# Altium schematic sheet P1.schdoc
size 297 x 209 mm; @Create Time: 14:32:22; @Board Name: Board1; @Update Time: 10:41:13; Border: 1; Title Block Position: 3; Width: 1170; Height: 825; Region Start: 1; X Region Count: 6; Y Region Count: 4; Blade Width: 10; Title Block: 1; Symbol: Sheet_WMY_A4; @Project Name: SparkinFP01; @Schematic Name: Schematic1; @Page Name: P1; @Page Count: 1; @Update Date: 2025-07-31; @Create Date: 2025-07-05; @Page No: 1; Drawed: Tomosawa; Device: Sheet_WMY_A4
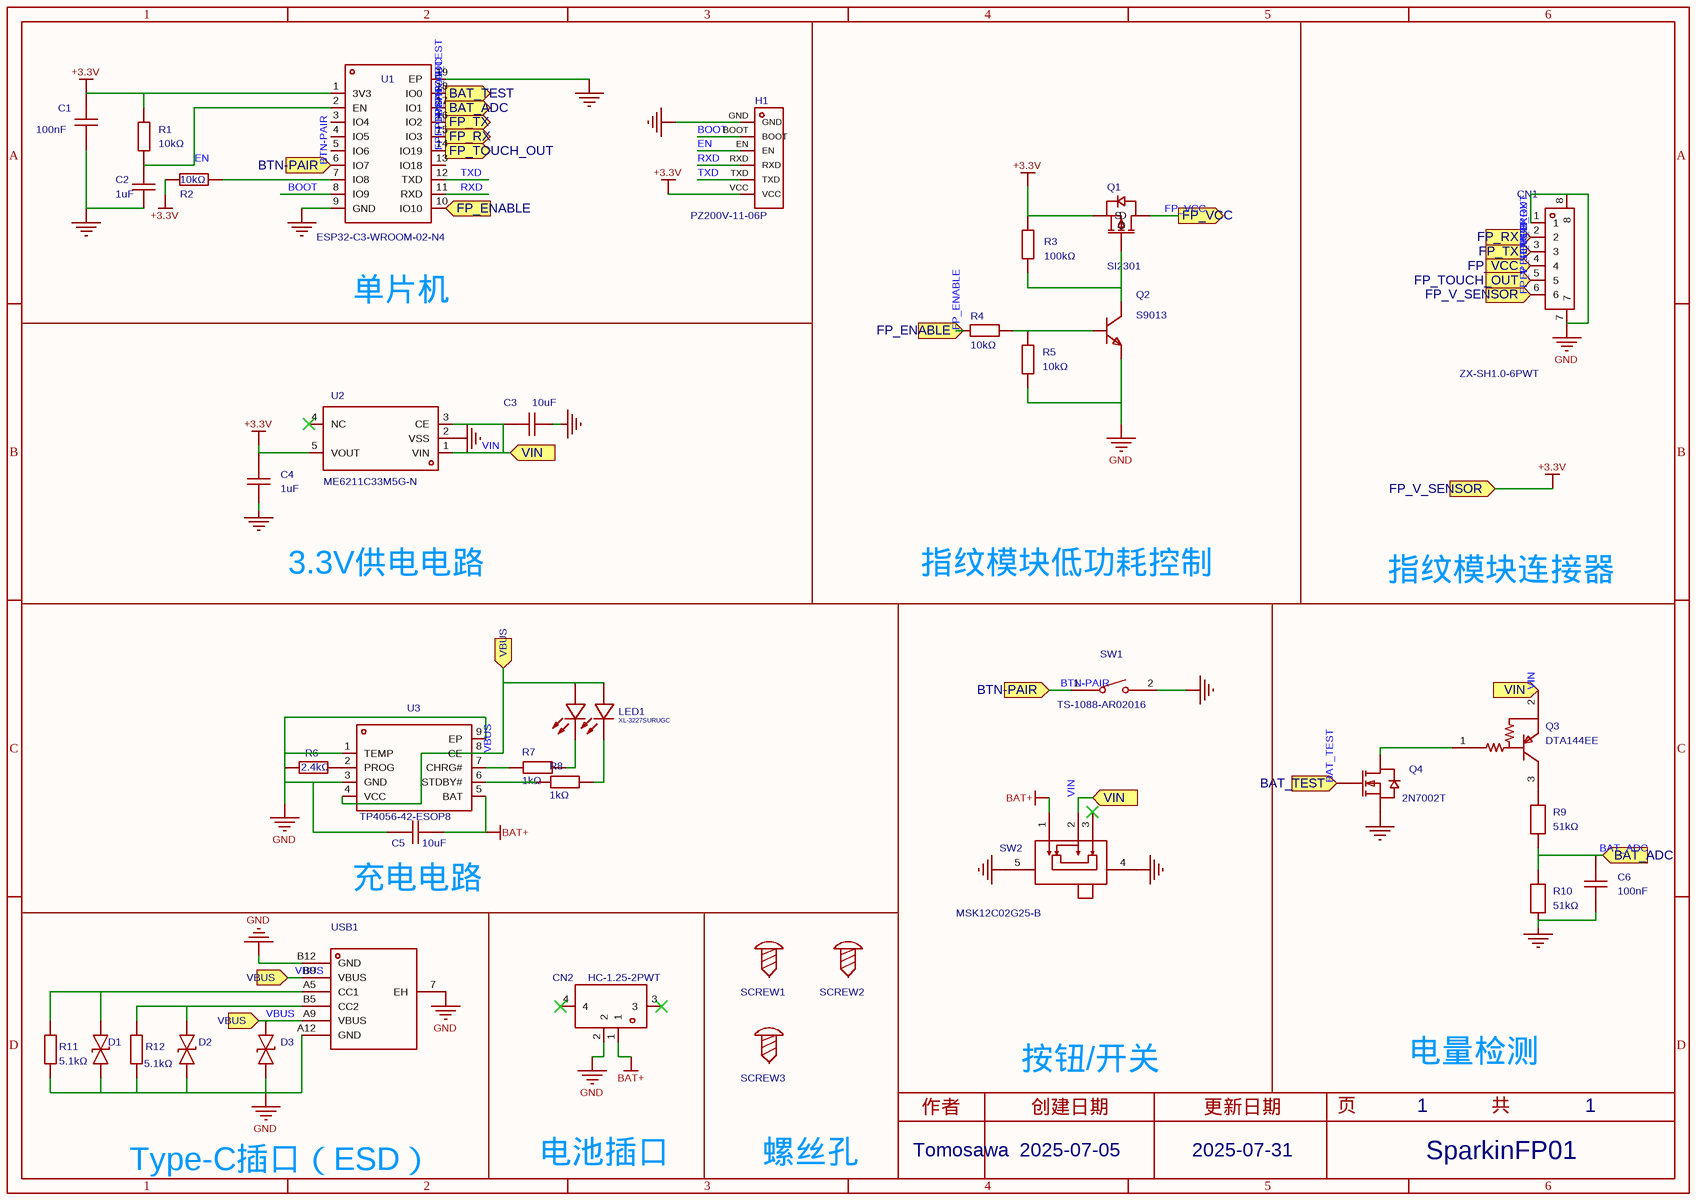
[diagram p0: P1.schdoc]

## Parts
C1  100nF  [C0603]
C2  1uF  [C0603]
C3  10uF  [C0603]
C4  1uF  [C0603]
C5  10uF  [C0603]
C6  100nF  [C0603]
CN1  ZX-SH1.0-6PWT  [CONN-SMD_6P-P1.00_MEGASTAR_ZX-SH1.0-6PWT]
CN2  HC-1.25-2PWT  [CONN-SMD_2P-P1.25-HC-1.25-2PWT]
D1  LESD5D5.0CT1G  [SOD-523_L1.2-W0.8-LS1.6-BI]  (value not drawn)
D2  LESD5D5.0CT1G  [SOD-523_L1.2-W0.8-LS1.6-BI]  (value not drawn)
D3  LESD5D5.0CT1G  [SOD-523_L1.2-W0.8-LS1.6-BI]  (value not drawn)
H1  PZ200V-11-06P  [6PIN-2MM-UART]
LED1  XL-3227SURUGC  [LED-SMD_4P-L3.2-W2.7-TL]
Q1  SI2301  [SOT-23-3_L2.9-W1.3-P1.90-LS2.4-BR]
Q2  S9013  [SOT-23-3_L2.9-W1.3-P1.90-LS2.4-BR]
Q3  DTA144EE  [SOT-523-3_L1.6-W0.8-P1.00-LS1.6-BR]
Q4  2N7002T  [SC-75-3_L1.6-W0.8-P1.00-LS1.7-BR]
R1  10kΩ  [R0603]
R2  10kΩ  [R0603]
R3  100kΩ  [R0603]
R4  10kΩ  [R0603]
R5  10kΩ  [R0603]
R6  2.4kΩ  [R0603]
R7  1kΩ  [R0603]
R8  1kΩ  [R0603]
R9  51kΩ  [R0603]
R10  51kΩ  [R0603]
R11  5.1kΩ  [R0603]
R12  5.1kΩ  [R0603]
SCREW1  (no value)  [M2螺丝]
SCREW2  (no value)  [M2螺丝]
SCREW3  (no value)  [M2螺丝]
SW1  TS-1088-AR02016  [SW-SMD_L3.9-W3.0-P4.45]
SW2  MSK12C02G25-B  [SW-SMD_MSK12C02G25-B]
U1  ESP32-C3-WROOM-02-N4  [BULETM-SMD_ESPRESSIF_ESP32-C3-WROOM-02-N4-4MB]
U2  ME6211C33M5G-N  [SOT-23-5_L3.0-W1.7-P0.95-LS2.8-BL]
U3  TP4056-42-ESOP8  [ESOP-8_L4.9-W3.9-P1.27-LS6.0-BL-EP]
USB1  TYPE-C 6P(073)  [TYPE-C-SMD_TYPE-C-6P_5]  (value not drawn)

## Ports
BAT_ADC (in), BAT_ADC (out), BAT_TEST (in), BAT_TEST (out), BTN-PAIR (in), FP_ENABLE (in), FP_RX (in), FP_RX (out), FP_TOUCH_OUT (in), FP_TOUCH_OUT (out), FP_TX (in), FP_TX (out), FP_V_SENSOR (in), FP_VCC (in), FP_VCC (out), VBUS (in), VIN (in)

## Nets
BAT+: C5.1 CN2.1 SW2.1 U3.5(BAT)
FP_V_SENSOR: C1.2 C4.2 CN1.6 H1.VCC Q1.2(S) R1.2 R2.2 R3.1 U1.1(3V3) U2.5(VOUT) ; port FP_V_SENSOR  [also labelled +3.3V]
GND: C1.1 C2.1 C3.1 C4.1 C5.2 C6.1 CN1.1 CN1.7 CN1.8 CN2.2 D1.2 D2.2 D3.2 H1.GND Q2.2(E) Q4.2(S) R5.1 R6.1 R10.1 R11.2 R12.2 SW1.2 SW2.4 SW2.5 U1.9(GND) U1.19(EP) U2.2(VSS) U3.1(TEMP) U3.3(GND) U3.9(EP) USB1.7(EH) USB1.A12(GND) USB1.B12(GND)
BAT_ADC: C6.2 R9.1 R10.2 U1.17(IO1) ; port BAT_ADC
BAT_TEST: Q4.1(G) U1.18(IO0) ; port BAT_TEST
BOOT: H1.BOOT U1.8(IO9)
BTN-PAIR: SW1.1 U1.6(IO7) ; port BTN-PAIR
EN: C2.2 H1.EN R1.1 U1.2(EN)
FP_ENABLE: R4.1 U1.10(IO10) ; port FP_ENABLE
FP_RX: CN1.2 U1.15(IO3) ; port FP_RX
FP_TOUCH_OUT: CN1.5 U1.14(IO19) ; port FP_TOUCH_OUT
FP_TX: CN1.3 U1.16(IO2) ; port FP_TX
FP_VCC: CN1.4 Q1.3(D) ; port FP_VCC
RXD: H1.RXD U1.11(RXD)
TXD: H1.TXD U1.12(TXD)
VBUS: D3.1 LED1.2 LED1.4 U3.4(VCC) U3.8(CE) USB1.A9(VBUS) USB1.B9(VBUS) ; port VBUS
VIN: C3.2 Q3.2(GND) SW2.2 U2.1(VIN) U2.3(CE) ; port VIN
NetD1_1: D1.1 R11.1 USB1.A5(CC1)
NetD2_1: D2.1 R12.1 USB1.B5(CC2)
NetLED1_1: LED1.1 R7.1
NetLED1_3: LED1.3 R8.1
NetQ1_1: Q1.1(G) Q2.3(C) R3.2
NetQ2_1: Q2.1(B) R4.2 R5.2
NetQ3_1: Q3.1(IN) Q4.3(D)
NetQ3_3: Q3.3(OUT) R9.2
NetR2_1: R2.1 U1.7(IO8)
NetR6_2: R6.2 U3.2(PROG)
NetR7_2: R7.2 U3.7(CHRG#)
NetR8_2: R8.2 U3.6(STDBY#)

Not connected (* = marked no-connect by the designer): CN2 3* 4*; SCREW1 1; SCREW2 1; SCREW3 1; SW2 3*; U1 3(IO4) 4(IO5) 5(IO6) 13(IO18); U2 4(NC)*

## Notes on the sheet
- 单片机
- 3.3V供电电路
- 指纹模块低功耗控制
- 指纹模块连接器
- (near C5) 充电电路
- 按钮/开关
- 电量检测
- Type-C插口（ESD）
- 电池插口
- 螺丝孔
- 1
- 2
- 3
- 4
- 5
- 6
- A
- B
- C
- D
- Tomosawa
- 作者
- 创建日期
- 2025-07-05
- 更新日期
- 2025-07-31
- 页
- 共
- SparkinFP01

## Library data of the parts
C1 = CL10B104KA8NNNC: 容值:100nF;精度:±10%;额定电压:25V;材质(温度系数):X7R;; Manufacturer: SAMSUNG(三星); Symbol: CapAcitance; AddInBom: yes; ModelId: ac125912035d415993ca9572d50418b1; ModelName: C0603_L1.6-W0.8-H0.8; ModelTransform: 62.992,31.496,0,0,0,0,0,0,0; Tolerance: ±10%; Voltage Rated: 25V; Temperature Coefficient: X7R; Device: CL10B104KA8NNNC; LCSC Part Name: 100nF ±10% 25V; SupplierPart: C1590; ManufacturerPart: CL10B104KA8NNNC; Supplier Footprint: 0603; JLCPCB Part Class: Extended Part; Datasheet: https://atta.szlcsc.com/upload/public/pdf/source/20160218/1457707763339.pdf; Supplier: LCSC; ConvertToPcb: yes; FootprintName: C0603; Value: 100nF
C2 = CL10A105KO8NNNC: 容值:1uF;精度:±10%;额定电压:16V;材质(温度系数):X5R;; Manufacturer: SAMSUNG(三星); AddInBom: yes; ModelId: ac125912035d415993ca9572d50418b1; ModelName: C0603_L1.6-W0.8-H0.8; ModelTransform: 62.992,31.496,0,0,0,0,0,0,0; Tolerance: ±10%; Voltage Rated: 16V; Temperature Coefficient: X5R; Symbol: CL10A105KO8NNNC; Device: CL10A105KO8NNNC; LCSC Part Name: 1uF ±10% 16V; SupplierPart: C1592; ManufacturerPart: CL10A105KO8NNNC; Supplier Footprint: 0603; JLCPCB Part Class: Extended Part; Datasheet: https://atta.szlcsc.com/upload/public/pdf/source/20220919/9FBE606BE0D9532D730F292EB26DC5BB.pdf; Supplier: LCSC; ConvertToPcb: yes; FootprintName: C0603; Value: 1uF
C3 = CL10A106KP8NNNC: 容值:10uF;精度:±10%;额定电压:10V;材质(温度系数):X5R;; Manufacturer: SAMSUNG(三星); Symbol: CL21A106KAYNNNE; AddInBom: yes; ModelId: ac125912035d415993ca9572d50418b1; ModelName: C0603_L1.6-W0.8-H0.8; ModelTransform: 62.992,31.496,0,0,0,0,0,0,0; Tolerance: ±10%; Voltage Rated: 10V; Temperature Coefficient: X5R; Device: CL10A106KP8NNNC; LCSC Part Name: 10uF ±10% 10V; SupplierPart: C19702; ManufacturerPart: CL10A106KP8NNNC; Supplier Footprint: 0603; JLCPCB Part Class: Basic Part; Datasheet: https://atta.szlcsc.com/upload/public/pdf/source/20160218/1457707763339.pdf; Supplier: LCSC; ConvertToPcb: yes; FootprintName: C0603; Value: 10uF
C4 = CL10A105KO8NNNC: 容值:1uF;精度:±10%;额定电压:16V;材质(温度系数):X5R;; Manufacturer: SAMSUNG(三星); Symbol: CL21A106KAYNNNE; AddInBom: yes; ModelId: ac125912035d415993ca9572d50418b1; ModelName: C0603_L1.6-W0.8-H0.8; ModelTransform: 62.992,31.496,0,0,0,0,0,0,0; Tolerance: ±10%; Voltage Rated: 16V; Temperature Coefficient: X5R; Device: CL10A105KO8NNNC; LCSC Part Name: 1uF ±10% 16V; SupplierPart: C1592; ManufacturerPart: CL10A105KO8NNNC; Supplier Footprint: 0603; JLCPCB Part Class: Extended Part; Datasheet: https://atta.szlcsc.com/upload/public/pdf/source/20220919/9FBE606BE0D9532D730F292EB26DC5BB.pdf; Supplier: LCSC; ConvertToPcb: yes; FootprintName: C0603; Value: 1uF
C5 = CL10A106KP8NNNC: 容值:10uF;精度:±10%;额定电压:10V;材质(温度系数):X5R;; Manufacturer: SAMSUNG(三星); Symbol: CL21A106KAYNNNE; Convert to PCB: yes; ModelId: ac125912035d415993ca9572d50418b1; ModelName: C0603_L1.6-W0.8-H0.8; ModelTransform: 62.992,31.496,0,0,0,0,0,0,0; Tolerance: ±10%; Voltage Rated: 10V; Temperature Coefficient: X5R; Origin Footprint: C0603; Device: CL10A106KP8NNNC; Add into BOM: yes; LCSC Part Name: 10uF ±10% 10V; SupplierPart: C19702; ManufacturerPart: CL10A106KP8NNNC; Supplier Footprint: 0603; JLCPCB Part Class: Basic Part; Datasheet: https://atta.szlcsc.com/upload/public/pdf/source/20160218/1457707763339.pdf; Supplier: LCSC; FootprintName: C0603; Value: 10uF
C6 = CL10B104KA8NNNC: 容值:100nF;精度:±10%;额定电压:25V;材质(温度系数):X7R;; Manufacturer: SAMSUNG(三星); Symbol: CL21A106KAYNNNE; AddInBom: yes; ModelId: ac125912035d415993ca9572d50418b1; ModelName: C0603_L1.6-W0.8-H0.8; ModelTransform: 62.992,31.496,0,0,0,0,0,0,0; Tolerance: ±10%; Voltage Rated: 25V; Temperature Coefficient: X7R; Device: CL10B104KA8NNNC; LCSC Part Name: 100nF ±10% 25V; SupplierPart: C1590; ManufacturerPart: CL10B104KA8NNNC; Supplier Footprint: 0603; JLCPCB Part Class: Extended Part; Datasheet: https://atta.szlcsc.com/upload/public/pdf/source/20160218/1457707763339.pdf; Supplier: LCSC; ConvertToPcb: yes; FootprintName: C0603; Value: 100nF
CN1 = ZX-SH1.0-6PWT: 插针结构:1x6P;间距:1mm;安装方式:卧贴;参考系列:SH;总PIN数:6P;排数:1;每排PIN数:6;行距:-;额定电流:1A;触头材质:黄铜;触头镀层:锡;工作温度:-;; Manufacturer: Megastar(兆星); Symbol: WAFER-SH1.0-6PWB; Convert to PCB: yes; ModelId: ea000062bcd546109ecb001317c45492; ModelTransform: 329.1332,198.8185,0,0,0,0,0.003,-7.877,0; Pins Structure: 1x6P; Pitch: 1mm; Reference Series: SH; Number of PINs Per Row: 6; Current Rating: 1A; Supplementary Features: 辅助焊脚; Z-Height of the Board: 3.15mm; X-Length of Bottom Edge on Board (Spacing Line): 8.35mm; Y-Width of Bottom Edge on Board: 5.05mm; Device: ZX-SH1.0-6PWT; Add into BOM: yes; LCSC Part Name: 1x6P 间距:1mm 卧贴 系列:SH; SupplierPart: C7430448; ManufacturerPart: ZX-SH1.0-6PWT; Supplier Footprint: SMD,P=1mm,卧贴; JLCPCB Part Class: Extended Part; Datasheet: https://atta.szlcsc.com/upload/public/pdf/source/20230619/677B156B919545DC550B043554513491.pdf; Supplier: LCSC; FootprintName: CONN-SMD_6P-P1.00_MEGASTAR_ZX-SH1.0-6PWT; ModelName: CONN-SMD_6P-P1.00_MEGASTAR_ZX-SH1.0-6PWT; Mounting Type: 卧贴; Number of Pins: 6P; Number of Rows: 1; Row Spacing: -; Contact Material: 黄铜; Contact Plating: 锡; Operating Temperature: -; Voltage Rating: -; Plastic Material: -; Flame Retardant Rating: -; Color: 米色
CN2 = HC-1.25-2PWT: 插针结构:1x2P;间距:1.25mm;安装方式:卧贴;参考系列:PicoBlade(MX 1.25);总PIN数:2P;排数:1;每排PIN数:2;行距:-;额定电流:1A;触头材质:黄铜;触头镀层:锡;工作温度范围:-40℃~+105℃;; Manufacturer: HCTL(华灿天禄); Convert to PCB: yes; ModelId: ebb1673ebb69408eb1694436aeec70a1; ModelTransform: 295.275,206.693,0,0,0,0,0,-39.372,0; Pins Structure: 1x2P; Pitch: 1.25mm; Number of PINs Per Row: 2; Current Rating (Max): 1A; Rated Voltage (Max): 125V; Plastic Material: LCP; Flame Retardant Rating: UL94V-0; Supplementary Features: 辅助焊脚; Z-Height of the Board: 3.57mm; X-Length of Bottom Edge on Board (Spacing Line): 7.55mm; Y-Width of Bottom Edge on Board: 5.25mm; Device: HC-1.25-2PWT; Symbol: HC-1.25-2PWT; Add into BOM: yes; LCSC Part Name: 1x2P 间距:1.25mm 卧贴 系列:PicoBlade(MX 1.25); SupplierPart: C2845379; ManufacturerPart: HC-1.25-2PWT; Supplier Footprint: SMD,P=1.25mm,卧贴; JLCPCB Part Class: Extended Part; Datasheet: https://atta.szlcsc.com/upload/public/pdf/source/20240930/9508A8292CCC87B0C29E3A028D56E30A.pdf; Supplier: LCSC; FootprintName: CONN-SMD_2P-P1.25-HC-1.25-2PWT; ModelName: CONN-SMD_2P-P1.25-HC-1.25-2PWT; Mounting Style: 卧贴; Reference Series: PicoBlade(MX 1.25); Number of Pins: 2P; Number of Rows: 1; Row Spacing: -; Contact Material: 黄铜; Contact Plating: 锡; Operating Temperature Range: -40℃~+105℃; Colour: -
D1-D3 = LESD5D5.0CT1G: 极性:Bidirectional;反向关断电压（典型值）:5V;击穿电压（最小值）:5.6V;箝位电压:18.6V;峰值脉冲电流（10/1000us）:9.4A (8/20us);; Manufacturer: LRC(乐山无线电); AddInBom: yes; ModelId: 8f56a03db567494d8f4c9d12aa52a741; ModelName: SOD-523_L1.2-W0.8-H0.7-LS1.6; ModelTransform: 62.992,31.496,0,0,0,0,0,0,0; Voltage - Reverse Standoff (Typ): 5V; Voltage - Breakdown (Min): 5.6V; Voltage - Clamping (Max) @ Ipp: 18.6V; Device: LESD5D5.0CT1G; Symbol: LESD5D5.0CT1G; LCSC Part Name: LESD5D5.0CT1G; SupplierPart: C383211; ManufacturerPart: LESD5D5.0CT1G; Supplier Footprint: SOD-523; JLCPCB Part Class: 扩展库; Datasheet: https://atta.szlcsc.com/upload/public/pdf/source/20190807/C383211_633DF4B4E2C161403226E5235FE33A1C.pdf; Supplier: LCSC; ConvertToPcb: yes; FootprintName: SOD-523_L1.2-W0.8-LS1.6-BI; Polarity: Bidirectional; Current - Peak Pulse (10/1000μs): 9.4A (8/20us)
H1 = 6PIN-2MM-UART: 串口烧录接口; Manufacturer: XFCN(兴飞); Check: false; Add into BOM: no; ConvertToPcb: yes; Pin Structure: 1x6P; Pitch: 2mm; Circluar Pins/Square Pins: 方针; Device: 6PIN-2MM-UART; Supplier: LCSC; SupplierPart: C541860; ManufacturerPart: PZ200V-11-06P; JLCPCB Part Class: Extended Part; LCSC Part Name: 间距:2mm 1x6P 直插 方针; Supplier Footprint: 插件,P=2mm; Datasheet: https://atta.szlcsc.com/upload/public/pdf/source/20200518/C541858_7610F54454E936EFCDE06B655DF7C837.pdf; Row Spacing: -; Mounting Type: 直插; Number of Rows: 单排; Number of Pins: 6P; Current Rating (Max): -; Voltage Rating (Max): -; Length of Mating Pin: 3.9mm; Insulation Height: 2mm; Length of End Connection Pin: 2.8mm; Contact Material: 黄铜; Contact Plating: -; Operating Temperature Range: -40℃~+105℃; Soldering Temperature(Max): -; Color: 黑色; SymbolName: PZ200V-11-06P
LED1 = XL-3227SURUGC: 发光颜色:红色,翠绿色;正向压降(Vf):2.4V；3.4V;功率:70mW；50mW;正向电流:20mA;波长:520nm~530nm；620nm~630nm;二极管配置:共阳极;透镜颜色:无色透明透镜;色温:-;发光强度:78mcd；280mcd;发光角度:120°;载带方式:正贴;工作温度:-;; Manufacturer: XINGLIGHT(成兴光); Convert to PCB: yes; Illumination Color: 红色,翠绿色; ModelId: 2624c96dc320433eb6054a3856ccfc8e; ModelName: LED-ARRAY-SMD_4P-L3.0-W2.5-H1.5-P1.5; ModelTransform: 118.8974,98.425,0,0,0,0,0,0,0; Forward Current: 20mA; Peak Wavelength: 625nm；525nm; Diode Configuration: 共阳极; Lens Color: 无色透明透镜; Viewing Angle: 120°; Mounting Sytle: 正贴; LCSC Part Name: 红翠绿双色贴片式发光二极管; Supplier Footprint: SMD-4P,3.2x2.7mm; Datasheet: https://item.szlcsc.com/datasheet/XL-3227SURUGC/1051451.html; Device: XL-3227SURUGC; Symbol: XL-3227SURUGC; Add into BOM: yes; Voltage - Forward(Vf): 2.4V；3.4V; Power(Watts): 70mW；50mW; Wavelength - Dominant: 520nm~530nm；620nm~630nm; Mounting Style: 正贴; Operating Temperature: -20℃~+85℃; SupplierPart: C965842; ManufacturerPart: XL-3227SURUGC; JLCPCB Part Class: Extended Part; Supplier: LCSC; FootprintName: LED-SMD_4P-L3.2-W2.7-TL; Emitted Color: 红色,翠绿色; Forward Voltage (VF): 2.4V；3.4V; Power Dissipation: 70mW；50mW; Dominant Wavelength: 520nm~530nm；620nm~630nm; Color Temperature: -; Luminous Intensity: 78mcd；280mcd
Q1 = SI2301_C2891731: 类型:1个P沟道;漏源电压(Vdss):20V;连续漏极电流(Id):2.2A;导通电阻(RDS(on)):120mΩ@4.5V,1.5A;耗散功率(Pd):700mW;阈值电压(Vgs(th)):-;; Manufacturer: YONGYUTAI(永裕泰); AddInBom: yes; Type: 1个P沟道; Drain to Source Voltage: 20V; Current - Continuous Drain(Id): 2.2A; Pd - Power Dissipation: 700mW; Input Capacitance(Ciss@Vds): 200pF@10V; ModelId: c62791f0466c4ae2a892c056b845b0ca; ModelName: SOT-23-3P_L2.9-W1.3-H1.0-LS2.4-P0.95; ModelTransform: 98.425,114.173,0,180,0,0,0.0005,-0.0005,0; Symbol: SI2301_C2891731; Device: SI2301_C2891731; LCSC Part Name: P沟道,电流:2.2A,耐压:20V; SupplierPart: C2891731; ManufacturerPart: SI2301; Supplier Footprint: SOT-23; JLCPCB Part Class: Extended Part; Datasheet: https://atta.szlcsc.com/upload/public/pdf/source/20210901/BD7F488CADB80954861F21BEE026F08A.pdf; Supplier: LCSC; ConvertToPcb: yes; RDS(on): 120mΩ@4.5V,1.5A; Gate Threshold Voltage (Vgs(th)@Id): -; Gate Charge(Qg): -; Reverse Transfer Capacitance (Crss@Vds): -; Operating Temperature: -55℃~+150℃; FootprintName: SOT-23-3_L2.9-W1.3-P1.90-LS2.4-BR
Q2 = S9013_C2891800: 晶体管类型:NPN;集电极电流(Ic):500mA;集射极击穿电压(Vceo):25V;耗散功率(Pd):300mW;直流电流增益(hFE):400@50mA,1V;; Manufacturer: YONGYUTAI(永裕泰); AddInBom: yes; ModelId: c62791f0466c4ae2a892c056b845b0ca; ModelName: SOT-23-3P_L2.9-W1.3-H1.0-LS2.4-P0.95; ModelTransform: 98.425,114.173,0,180,0,0,0.0005,-0.0005,0; type: NPN; Current - Collector(Ic): 500mA; Collector - Emitter Voltage VCEO: 25V; Pd - Power Dissipation: 300mW; Current - Collector Cutoff: 1uA; Vce Saturation(VCE(sat)): 500mV; Symbol: S9013_C2891800; Device: S9013_C2891800; LCSC Part Name: S9013; SupplierPart: C2891800; ManufacturerPart: S9013; Supplier Footprint: SOT-23; JLCPCB Part Class: Extended Part; Datasheet: https://atta.szlcsc.com/upload/public/pdf/source/20210901/D431C9F57CC026183A9A17AA4C687C10.pdf; Supplier: LCSC; ConvertToPcb: yes; FootprintName: SOT-23-3_L2.9-W1.3-P1.90-LS2.4-BR; DC Current Gain: 400@50mA,1V; Transition frequency(fT): -; Operating Temperature: -
Q3 = DTA144EE_C2991974: 集射极击穿电压(Vceo):50V;集电极电流(Ic):30mA;功率(Pd):150mW;直流电流增益(hFE@Ic,Vce):68@5mA,5V;; Manufacturer: CJ(江苏长电/长晶); AddInBom: yes; ModelId: 3e7fadd59d8d474faa89c2c7e0676879; ModelName: SOT-523-3P_L1.6-W0.8-H0.9-LS1.6-P0.50; ModelTransform: 62.992,62.214,0,180,0,0,0,0,0; Collector-Emitter Breakdown Voltage (Vceo): 50V; Collector Current (Ic): 30mA; Power Dissipation (Pd): 150mW; Input Voltage (VI(on)@Ic,Vce): 3V@2mA,0.3V; Input Voltage (VI(off)@Ic,Vce): 500mV@100uA,5V; Output Voltage (VO(on)@Io/Ii): 300mV@10mA,0.5mA; Input Resistor: 61.1kΩ; Symbol: DTA144EE_C2991974; Device: DTA144EE_C2991974; LCSC Part Name: 耐压:50V 电流:30mA; SupplierPart: C2991974; ManufacturerPart: DTA144EE; Supplier Footprint: SOT-523-3; JLCPCB Part Class: Extended Part; Datasheet: https://atta.szlcsc.com/upload/public/pdf/source/20220119/D86C67A676761A73E5DEE01FFA6B31ED.pdf; Supplier: LCSC; ConvertToPcb: yes; FootprintName: SOT-523-3_L1.6-W0.8-P1.00-LS1.6-BR; DC Current Gain (hFE@Ic,Vce): 68@5mA,5V; Resistor Ratio: -; Operating Temperature: -55℃~+150℃
Q4 = 2N7002T_C40106: 类型:1个N沟道;漏源电压(Vdss):60V;连续漏极电流(Id):115mA;导通电阻(RDS(on)):7.5Ω@5V,50mA;耗散功率(Pd):-;阈值电压(Vgs(th)):-;; Manufacturer: CJ(江苏长电/长晶); 3D Model: c91d337f73514bed9e4f5de3964a5f78; 3D Model Transform: 63.48633,62.992,0,180,0,0,0,0.005,0; Type: 1个N沟道; Drain to Source Voltage: 60V; Current - Continuous Drain(Id): 115mA; AddInBom: yes; ModelName: SC-75-3_L1.6-W0.8-H0.9-LS1.6-P1.0; Symbol: 2N7002T; Device: 2N7002T_C40106; LCSC Part Name: 1个N沟道 耐压:60V 电流:115mA; Supplier Part: C40106; Manufacturer Part: 2N7002T; Supplier Footprint: SC-75(SOT-523); JLCPCB Part Class: Extended Part; Datasheet: https://atta.szlcsc.com/upload/public/pdf/source/20141219/1457707256656.pdf; Supplier: LCSC; RDS(on): 7.5Ω@5V,50mA; Pd - Power Dissipation: -; Gate Threshold Voltage (Vgs(th)@Id): -; ConvertToPcb: yes; FootprintName: SC-75-3_L1.6-W0.8-P1.00-LS1.7-BR
R1 R2 = 0603WAF1002T5E: 电阻类型:厚膜电阻;阻值:10kΩ;精度:±1%;功率:100mW;最大工作电压:75V;温度系数:±100ppm/℃;; Manufacturer: UNI-ROYAL(厚声); Symbol: 电阻; AddInBom: yes; ModelId: fc143cca1e79419f9cd78b61e9279f08; ModelTransform: 31.8897,63.7794,0,90,0,0,0,0,0; Tolerance: ±1%; Power(Watts): 100mW; Overload Voltage (Max): 75V; Device: 0603WAF1002T5E; LCSC Part Name: 厚膜电阻 10kΩ ±1% 100mW; SupplierPart: C25804; ManufacturerPart: 0603WAF1002T5E; Supplier Footprint: 0603; JLCPCB Part Class: Basic Part; Datasheet: https://atta.szlcsc.com/upload/public/pdf/source/20200306/C422600_1E6D84923E4A46A82E41ADD87F860B5C.pdf; Supplier: LCSC; ConvertToPcb: yes; FootprintName: R0603; ModelName: R0603; Type: 厚膜电阻; Value: 10kΩ; Temperature Coefficient: ±100ppm/℃; Operating Temperature Range: -55℃~+155℃
R3 = 0603WAF1003T5E: 电阻类型:厚膜电阻;阻值:100kΩ;精度:±1%;功率:100mW;最大工作电压:75V;温度系数:±100ppm/℃;; Manufacturer: UNI-ROYAL(厚声); Convert to PCB: yes; ModelId: fc143cca1e79419f9cd78b61e9279f08; ModelTransform: 31.8897,63.7794,0,90,0,0,0,0,0; Tolerance: ±1%; Power(Watts): 100mW; Overload Voltage (Max): 75V; Device: 0603WAF1003T5E; Symbol: 0603WAF1003T5E; Add into BOM: yes; LCSC Part Name: 100kΩ ±1% 100mW 厚膜电阻; SupplierPart: C25803; ManufacturerPart: 0603WAF1003T5E; Supplier Footprint: 0603; JLCPCB Part Class: Basic Part; Datasheet: https://atta.szlcsc.com/upload/public/pdf/source/20200306/C422600_1E6D84923E4A46A82E41ADD87F860B5C.pdf; Supplier: LCSC; FootprintName: R0603; ModelName: R0603; Type: 厚膜电阻; Value: 100kΩ; Temperature Coefficient: ±100ppm/℃; Operating Temperature Range: -55℃~+155℃
R4 R5 = 0603WAF1002T5E: 电阻类型:厚膜电阻;阻值:10kΩ;精度:±1%;功率:100mW;工作电压:75V;温度系数:±100ppm/℃;; Manufacturer: UNI-ROYAL(厚声); Convert to PCB: yes; Voltage-Supply(Max): 75V; ModelId: fc143cca1e79419f9cd78b61e9279f08; ModelTransform: 31.8897,63.7794,0,90,0,0,0,0,0; Tolerance: ±1%; Power(Watts): 100mW; Device: 0603WAF1002T5E; Symbol: 0603WAF1002T5E; Add into BOM: yes; Operating Temperature: -55℃~+155℃; LCSC Part Name: 厚膜电阻 10kΩ ±1% 100mW; SupplierPart: C25804; ManufacturerPart: 0603WAF1002T5E; Supplier Footprint: 0603; JLCPCB Part Class: Basic Part; Datasheet: https://atta.szlcsc.com/upload/public/pdf/source/20200306/C422600_1E6D84923E4A46A82E41ADD87F860B5C.pdf; Supplier: LCSC; FootprintName: R0603; ModelName: R0603; Type: 厚膜电阻; Value: 10kΩ; Overload Voltage (Max): 75V; Temperature Coefficient: ±100ppm/℃; Operating Temperature Range: -55℃~+155℃
R6 = 0603WAF2401T5E: 电阻类型:厚膜电阻;阻值:2.4kΩ;精度:±1%;功率:100mW;最大工作电压:75V;温度系数:±100ppm/℃;; Manufacturer: UNI-ROYAL(厚声); Symbol: 0603WAF1201T5E; Convert to PCB: yes; ModelId: fc143cca1e79419f9cd78b61e9279f08; ModelTransform: 31.8897,63.7794,0,90,0,0,0,0,0; Tolerance: ±1%; Power(Watts): 100mW; Overload Voltage (Max): 75V; Supplier Part: C22940; Supplier: LCSC; Manufacturer Part: 0603WAF2401T5E; Device: 0603WAF2401T5E; Add into BOM: yes; JLCPCB Part Class: Basic Part; Value: 2.4kΩ; LCSC Part Name: 2.4kΩ ±1% 100mW 厚膜电阻; Supplier Footprint: 0603; Datasheet: https://atta.szlcsc.com/upload/public/pdf/source/20200306/C422600_1E6D84923E4A46A82E41ADD87F860B5C.pdf; FootprintName: R0603; ModelName: R0603; Type: 厚膜电阻; Temperature Coefficient: ±100ppm/℃; Operating Temperature Range: -55℃~+155℃
R7 R8 = 0603WAF1001T5E: 电阻类型:厚膜电阻;阻值:1kΩ;精度:±1%;功率:100mW;最大工作电压:75V;温度系数:±100ppm/℃;; Manufacturer: UNI-ROYAL(厚声); Symbol: RC0603FR-071KL; Convert to PCB: yes; ModelId: fc143cca1e79419f9cd78b61e9279f08; ModelTransform: 31.8897,63.7794,0,90,0,0,0,0,0; Tolerance: ±1%; Power(Watts): 100mW; Overload Voltage (Max): 75V; LCSC Part Name: 1kΩ ±1% 100mW 厚膜电阻; JLCPCB Part Class: Basic Part; Device: 0603WAF1001T5E; Add into BOM: yes; SupplierPart: C21190; ManufacturerPart: 0603WAF1001T5E; Supplier Footprint: 0603; Datasheet: https://atta.szlcsc.com/upload/public/pdf/source/20200306/C422600_1E6D84923E4A46A82E41ADD87F860B5C.pdf; Supplier: LCSC; FootprintName: R0603; ModelName: R0603; Type: 厚膜电阻; Value: 1kΩ; Temperature Coefficient: ±100ppm/℃; Operating Temperature Range: -55℃~+155℃
R9 = RT0603BRD0751KL: 电阻类型:薄膜电阻;阻值:51kΩ;精度:±0.1%;功率:100mW;最大工作电压:75V;温度系数:±25ppm/℃;; Manufacturer: YAGEO(国巨); Symbol: RT0603BRD0720KL; AddInBom: yes; ModelId: fc143cca1e79419f9cd78b61e9279f08; ModelTransform: 31.8897,63.7794,0,90,0,0,0,0,0; Tolerance: ±0.1%; Power(Watts): 100mW; Overload Voltage (Max): 75V; Device: RT0603BRD0751KL; LCSC Part Name: 薄膜电阻 51kΩ ±0.1% 100mW; SupplierPart: C861458; ManufacturerPart: RT0603BRD0751KL; Supplier Footprint: 0603; JLCPCB Part Class: Extended Part; Datasheet: https://atta.szlcsc.com/upload/public/pdf/source/20210709/C861458_B07C6FAEF2B3A6A40F135D9DC074A47F.pdf; Supplier: LCSC; ConvertToPcb: yes; FootprintName: R0603; ModelName: R0603; Type: 薄膜电阻; Value: 51kΩ; Temperature Coefficient: ±25ppm/℃; Operating Temperature Range: -55℃~+155℃
R10 = RT0603BRD0751KL: 电阻类型:薄膜电阻;阻值:51kΩ;精度:±0.1%;功率:100mW;最大工作电压:75V;温度系数:±25ppm/℃;; Manufacturer: YAGEO(国巨); Symbol: RT0603BRD0750KL; AddInBom: yes; ModelId: fc143cca1e79419f9cd78b61e9279f08; ModelTransform: 31.8897,63.7794,0,90,0,0,0,0,0; Tolerance: ±0.1%; Power(Watts): 100mW; Overload Voltage (Max): 75V; Device: RT0603BRD0751KL; LCSC Part Name: 薄膜电阻 51kΩ ±0.1% 100mW; SupplierPart: C861458; ManufacturerPart: RT0603BRD0751KL; Supplier Footprint: 0603; JLCPCB Part Class: Extended Part; Datasheet: https://atta.szlcsc.com/upload/public/pdf/source/20210709/C861458_B07C6FAEF2B3A6A40F135D9DC074A47F.pdf; Supplier: LCSC; ConvertToPcb: yes; FootprintName: R0603; ModelName: R0603; Type: 薄膜电阻; Value: 51kΩ; Temperature Coefficient: ±25ppm/℃; Operating Temperature Range: -55℃~+155℃
R11 R12 = 0603WAF5101T5E: 电阻类型:厚膜电阻;阻值:5.1kΩ;精度:±1%;功率:100mW;最大工作电压:75V;温度系数:±100ppm/℃;; Manufacturer: UNI-ROYAL(厚声); Convert to PCB: yes; ModelId: fc143cca1e79419f9cd78b61e9279f08; ModelTransform: 31.8897,63.7794,0,90,0,0,0,0,0; Tolerance: ±1%; Power(Watts): 100mW; Overload Voltage (Max): 75V; Device: 0603WAF5101T5E; Symbol: 0603WAF5101T5E; Add into BOM: yes; LCSC Part Name: 5.1kΩ ±1% 100mW 厚膜电阻; SupplierPart: C23186; ManufacturerPart: 0603WAF5101T5E; Supplier Footprint: 0603; JLCPCB Part Class: Basic Part; Datasheet: https://atta.szlcsc.com/upload/public/pdf/source/20200306/C422600_1E6D84923E4A46A82E41ADD87F860B5C.pdf; Supplier: LCSC; FootprintName: R0603; ModelName: R0603; Type: 厚膜电阻; Value: 5.1kΩ; Temperature Coefficient: ±100ppm/℃; Operating Temperature Range: -55℃~+155℃
SCREW1-SCREW3 = M2螺丝: ConvertToPcb: yes; SymbolName: 螺丝孔; Device: M2螺丝; AddInBom: yes; Supplier Footprint: 插件; FootprintName: M2螺丝
SW1 = TS-1088-AR02016: 电路结构:单刀单掷;按钮形状:圆形按钮;作用力:160gf;安装方式:立贴;开关长度:4mm;开关宽度:3mm;开关高度:2mm;带支架:不带;触点电流:50mA;额定电压(DC):12V;绝缘电阻:100MΩ;机械寿命:10万次;; Manufacturer: XUNPU(讯普); AddInBom: yes; ModelId: b26698b69f274ffabef8a26c7d0e5dd1; ModelName: SW-SMD_L3.9-W2.9-H2.0-LS4.8; ModelTransform: 188.976,114.174,0,0,0,0,0,0,0; Circuit: 单刀单掷; Actuator Style: 圆形按钮; Operating Force: 160gf; Switch Length: 4mm; Switch Width: 3mm; Switch Height: 2mm; Strike Gundam: 不带; Contact Current: 50mA; Voltage Rating (DC): 12V; Insulation Resistance: 100MΩ; Actuator/Cap Color: 黑色; Pin Style: SMD接片; Mechanical Life: 10万次; Symbol: TS-1088-AR02016; Device: TS-1088-AR02016; LCSC Part Name: 4*3*2mm 立贴 轻触开关; SupplierPart: C720477; ManufacturerPart: TS-1088-AR02016; Supplier Footprint: SMD; JLCPCB Part Class: Basic Part; Datasheet: https://atta.szlcsc.com/upload/public/pdf/source/20200810/C720475_60D09DD6C54279ADDB2DC25100F1CC11.pdf; Supplier: LCSC; ConvertToPcb: yes; FootprintName: SW-SMD_L3.9-W3.0-P4.45; Mounting Style: 立贴; Operating Temperature: -30℃~+80℃
SW2 = MSK12C02G25-B: 七脚小拨动 贴片 侧拨两档 黑柄2.5H; Manufacturer: HanElectricity(瀚源); AddInBom: yes; ModelId: 5112e07cb51d4c68925dfb0429e9ca27; ModelTransform: 309.0545,246.0625,0,180,0,0,-0.002,45.902,-19.685; Symbol: MSK12C02G25-B; Device: MSK12C02G25-B; LCSC Part Name: MSK12C02G25-B; SupplierPart: C22435663; ManufacturerPart: MSK12C02G25-B; Supplier Footprint: SMD-7P,6.7x2.8mm; JLCPCB Part Class: Extended Part; Datasheet: https://atta.szlcsc.com/upload/public/pdf/source/20240521/17337E91FD453FDEAC1202186F2D9543.pdf; Supplier: LCSC; ConvertToPcb: yes; FootprintName: SW-SMD_MSK12C02G25-B; ModelName: SW-SMD_MSK12C02G25-B
U1 = ESP32-C3-WROOM-02-N4: 核心处理器:ESP32-C3芯片;频率:2.4GHz;发射功率:20.5dBm;; Manufacturer: ESPRESSIF(乐鑫); Symbol: ESP32-C3-WROOM-02-N4(4MB); AddInBom: yes; ModelId: b84a3a07460a410dbd2d87addaa4e9c5; ModelTransform: 709.4474,787.4,0,0,0,0,-0.001,122.048,0; Support Interface: I2C；GPIO；SPI；JTAG；UART；USB；I2S; Value: 2.4GHz; Device: ESP32-C3-WROOM-02-N4; LCSC Part Name: ESP32-C3-WROOM-02-N4; SupplierPart: C2934560; ManufacturerPart: ESP32-C3-WROOM-02-N4; Supplier Footprint: VFQFN-32-EP; JLCPCB Part Class: Extended Part; Datasheet: https://atta.szlcsc.com/upload/public/pdf/source/20220106/F07459EFFE1D7CBA94B4FB8A075146A6.pdf; Supplier: LCSC; ConvertToPcb: yes; FootprintName: BULETM-SMD_ESPRESSIF_ESP32-C3-WROOM-02-N4-4MB; ModelName: BULETM-SMD_ESPRESSIF_ESP32-C3-WROOM-02-N4-4MB; Core Processor: ESP32-C3芯片; Output Power: 20.5dBm
U2 = ME6211C33M5G-N: 输出类型:固定;最大输入电压:6V;输出电压:3.3V;最大输出电流:500mA;电源纹波抑制比(PSRR):70dB;输出极性:正极;; Manufacturer: MICRONE(南京微盟); AddInBom: yes; ModelId: 0a2a1b8f50944f73965918ad6e5fe167; ModelName: SOT-23-5_L2.9-W1.6-H1.1-LS2.8-P0.95; ModelTransform: 118.60433,114.173,0,90,0,0,0.0005,0.0005,0; Output Type: 固定; Maximum Input Voltage: 6V; Output Voltage: 3.3V; MAX Output Current: 500mA; Power Supply Rejection Ratio (PSRR): 70dB; Dropout Voltage: 260mV@(200mA); Output Polarity: 正极; Number of Outputs: 1; Symbol: ME6211C33M5G-N; Device: ME6211C33M5G-N; LCSC Part Name: 输入6V 输出3.3V 500mA; SupplierPart: C82942; ManufacturerPart: ME6211C33M5G-N; Supplier Footprint: SOT-23-5; JLCPCB Part Class: Extended Part; Datasheet: https://atta.szlcsc.com/upload/public/pdf/source/20170918/C82942_1505727073070976520.pdf; Supplier: LCSC; ConvertToPcb: yes; FootprintName: SOT-23-5_L3.0-W1.7-P0.95-LS2.8-BL
U3 = TP4056-42-ESOP8: 锂电池充电芯片 42代表电池满电电压4.2V。; Manufacturer: TOPPOWER(南京拓微); Symbol: TP4056; Convert to PCB: yes; ModelId: d3e00daa36c445139c055a3b9efb85d2; ModelName: ESOP-8_L4.9-W3.9-H1.6-LS6.0-P1.27; ModelTransform: 240.157,192.913,0,90,0,0,0,0,0; Origin Footprint: ESOP-8_L4.9-W3.9-P1.27-LS6.0-BL-EP; Device: TP4056-42-ESOP8; Add into BOM: yes; LCSC Part Name: TP4056-42-ESOP8; SupplierPart: C16581; ManufacturerPart: TP4056-42-ESOP8; Supplier Footprint: ESOP-8; JLCPCB Part Class: Extended Part; Datasheet: https://atta.szlcsc.com/upload/public/pdf/source/20190626/C16581_611BCF5D7CF554EAE465137A8F68DB3E.pdf; Supplier: LCSC; FootprintName: ESOP-8_L4.9-W3.9-P1.27-LS6.0-BL-EP
USB1 = TYPE-C 6P(073): 连接器类型:Type-C;标准:USB 3.1;公母:母;安装方式:卧贴;触点数量:6P;端口数量:1;额定电流 - 电源:3A;工作温度范围:-25℃~+85℃;; Manufacturer: SHOU HAN(首韩); AddInBom: yes; ModelId: 72c95d6789974114a5f214d0c40d3ddd; ModelTransform: 351.9678,271.653,0,0,0,0,0,-46.496,-39.37; Gender: 母; Number of Ports: 1; Current Rating - Power (Max): 3A; Rated Voltage (Max): 5V; Connect-Disconnect Life: 1万次; Core Colour: 黑色; Symbol: TYPE-C 6P(073); Device: TYPE-C 6P(073); Supplier Part: C668623; Manufacturer Part: TYPE-C 6P(073); JLCPCB Part Class: Extended Part; Supplier: LCSC; LCSC Part Name: Type-C 母 卧贴; Supplier Footprint: SMD; Datasheet: https://atta.szlcsc.com/upload/public/pdf/source/20200618/C668623_A4B260DED7AC1949BAC6AE39E9F4CD80.pdf; ConvertToPcb: yes; FootprintName: TYPE-C-SMD_TYPE-C-6P_5; ModelName: TYPE-C-SMD_TYPE-C-6P_5; Connector Type: Type-C; Standard: USB 3.1; Mounting Style: 卧贴; Number of Contacts: 6P; Operating Temperature Range: -25℃~+85℃